# EAGLE schematic atmega328_Arduino (EAGLE 6.4)
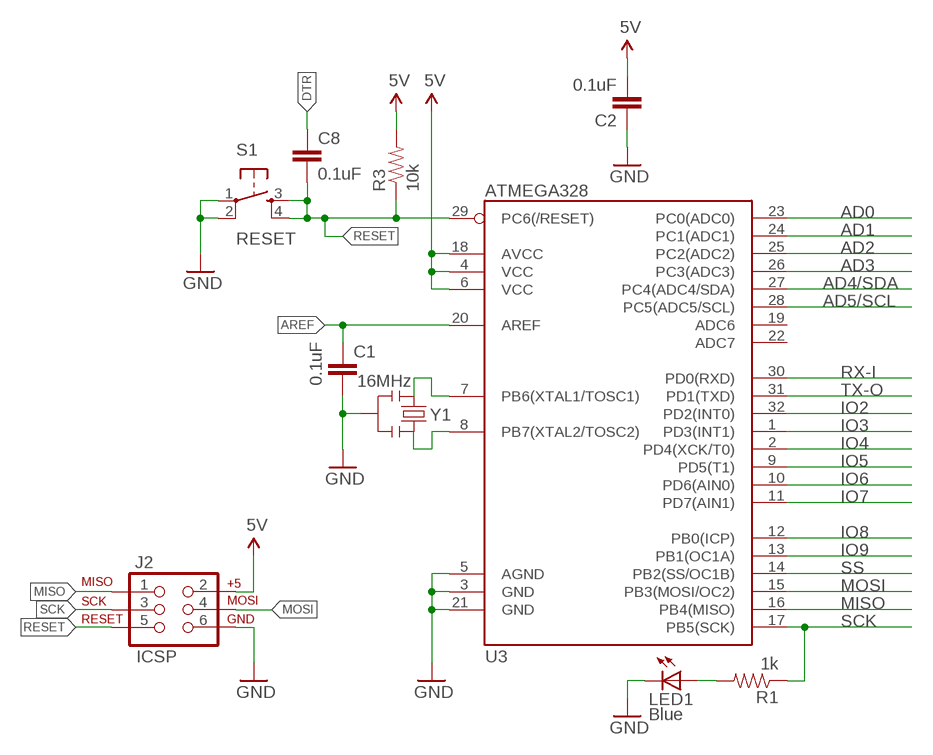
[diagram p0: schematic, sheet 1]

## Parts
C1  0.1uF  CAP0603-CAP  [0603-CAP]
C2  0.1uF  CAP0603-CAP  [0603-CAP]
C8  0.1uF  CAP0603-CAP  [0603-CAP]
J2  ICSP  AVR_SPI_PRG_6SMT_MALE  [2X3_SMT_POSTS]
LED1  Blue  LED1206-NS  [LED-1206-NO_SILK]
R1  1k  RESISTOR0603-RES  [0603-RES]
R3  10k  RESISTOR0603-RES  [0603-RES]
S1  RESET  TAC_SWITCHSMD  [TACTILE_SWITCH_SMD]
U3  ATMEGA328  ATMEGA168  [TQFP32-08]
Y1  16MHz  RESONATORSMD  [RESONATOR-SMD]

## Nets
5V: C2.2 J2.2 R3.2 U3.4(VCC) U3.6(VCC) U3.18(AVCC)
AD0: U3.23(PC0(ADC0))
AD1: U3.24(PC1(ADC1))
AD2: U3.25(PC2(ADC2))
AD3: U3.26(PC3(ADC3))
AD4/SDA: U3.27(PC4(ADC4/SDA))
AD5/SCL: U3.28(PC5(ADC5/SCL))
AREF: C1.1 U3.20(AREF)
DTR: C8.1
GND: C1.2 C2.1 J2.6 LED1.C S1.1 S1.2 U3.3(GND) U3.5(AGND) U3.21(GND) Y1.2
IO2: U3.32(PD2(INT0))
IO3: U3.1(PD3(INT1))
IO4: U3.2(PD4(XCK/T0))
IO5: U3.9(PD5(T1))
IO6: U3.10(PD6(AIN0))
IO7: U3.11(PD7(AIN1))
IO8: U3.12(PB0(ICP))
IO9: U3.13(PB1(OC1A))
MISO: J2.1 U3.16(PB4(MISO))
MOSI: J2.4 U3.15(PB3(MOSI/OC2))
N$1: LED1.A R1.2
N$3: U3.7(PB6(XTAL1/TOSC1)) Y1.1
N$4: U3.8(PB7(XTAL2/TOSC2)) Y1.3
RESET: C8.2 J2.5 R3.1 S1.3 S1.4 U3.29(PC6(/RESET))
RX-I: U3.30(PD0(RXD))
SCK: J2.3 R1.1 U3.17(PB5(SCK))
SS: U3.14(PB2(SS/OC1B))
TX-O: U3.31(PD1(TXD))
Unconnected: U3.19(ADC6) U3.22(ADC7)

## Library data of the parts
C1 C2 C8 = SparkFun:CAP: Capacitor Standard 0603 ceramic capacitor, and 0.1" leaded capacitor.
J2 = SparkFun-Connectors:AVR_SPI_PRG_6: AVR ISP 6 Pin This is the reduced ISP connector for AVR programming. Common on Arduino. This footprint will take up less PCB space and can be used with a 10-pin to 6-pin adapter such as SKU: BOB-08508
LED1 = SparkFun-LED:LED: LEDs Standard schematic elements and footprints for 5mm, 3mm, 1206, and 0603 sized LEDs. 5mm - Spark Fun Electronics SKU : COM-00529 (and others)
R1 R3 = SparkFun:RESISTOR: Resistor Basic schematic elements and footprints for 0603, 1206, and PTH resistors.
S1 = SparkFun:TAC_SWITCH: Momentary Switch Button commonly used for reset or general input. Spark Fun Electronics SKU : COM-00097
U3 = SparkFun:ATMEGA168
Y1 = SparkFun-FreqCtrl:RESONATOR: Resonator Small SMD resonator. This is the itty bitty 10/20MHz resonators with built in caps. CSTCE10M0G55 and CSTCE20M0V53. Footprint has been reviewed closely but hasn't been tested yet.

## Net classes
0 default: width 0.152 mm, drill 0.305 mm, clearance 0.152 mm